# Altium project POE-3V3-Board.PrjPcb
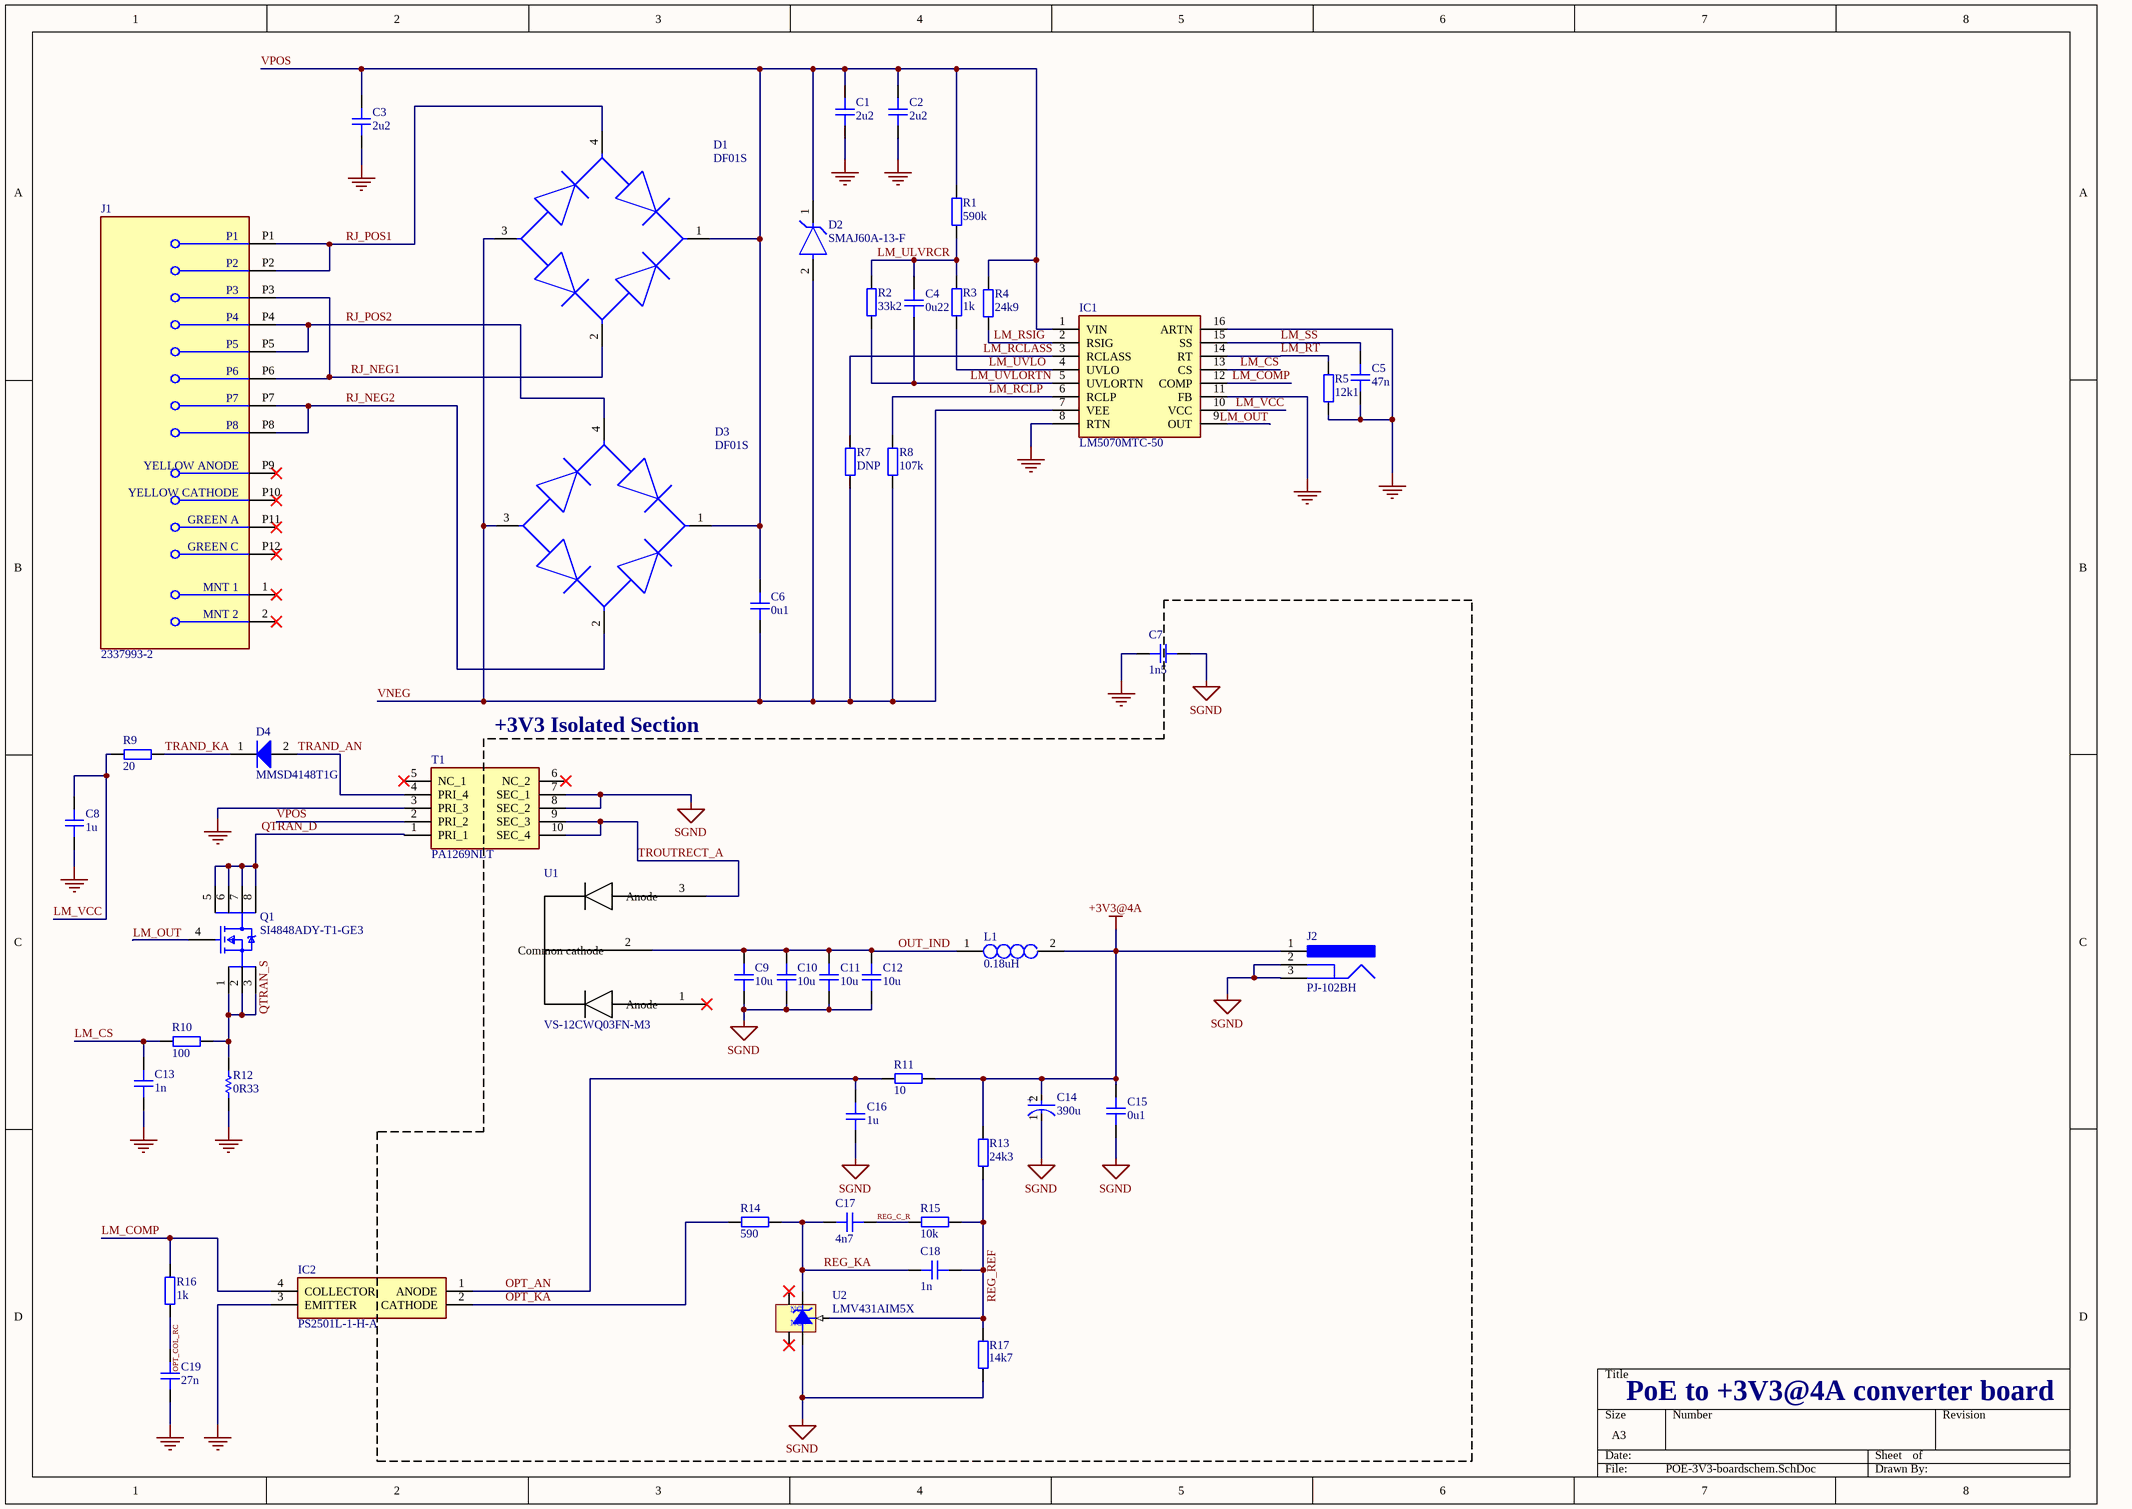
[diagram p0: POE-3V3-boardschem.SchDoc]
1 sheet, 48 parts. Net scope: global (net labels, ports and power ports of the same name join across sheets).
Board file: POE-3V3-PCB.PcbDoc

## Sheet POE-3V3-boardschem.SchDoc
size A3; SheetNumber: 1; SheetTotal: 1

### Parts
C1  2u2  [CAP_0805]
C2  2u2  [CAP_0805]
C3  2u2  [CAP_0805]
C4  0u22  [CAP_0805]
C5  47n  [CAP_0805]
C6  0u1  [CAP_0805]
C7  1n5  [CAP_0805]
C8  1u  [CAP_0805]
C9  10u  [CAP_1206]
C10  10u  [CAP_1206]
C11  10u  [CAP_1206]
C12  10u  [CAP_1206]
C13  1n  [CAP_0805]
C14  390u  [FP-RAD-TH-D_8_0_5-L_15_1-MFG]
C15  0u1  [CAP_0805]
C16  1u  [CAP_1206]
C17  4n7  [CAP_1206]
C18  1n  [CAP_1206]
C19  27n  [CAP_1206]
D1  DF01S  [FP-DF-S-MFG]
D2  SMAJ60A-13-F  [FP-SMA-MFG]
D3  DF01S  [FP-DF-S-MFG]
D4  MMSD4148T1G  [ONSC-SOD-123-2-425-04_V]
IC1  LM5070MTC-50  [SOP65P640X120-16N]
IC2  PS2501L-1-H-A  [SOP254P960X400-4N]
J1  2337993-2  [FP-2337993-2-MFG]
J2  PJ-102BH  [CUI-PJ-102BH_V]
L1  0.18uH  [DO1813H181MLD]
Q1  SI4848ADY-T1-GE3  [FP-C-06527-MFG]
R1  590k  [RES_0805]
R2  33k2  [RES_0805]
R3  1k  [RES_0805]
R4  24k9  [RES_0805]
R5  12k1  [RES_0805]
R7  DNP  [RES_0805]
R8  107k  [RES_0805]
R9  20  [RES_0805]
R10  100  [RES_0805]
R11  10  [RES_0805]
R12  0R33  [RESC3126X65X50NL10T20]
R13  24k3  [RES_0805]
R14  590  [RES_0805]
R15  10k  [RES_0805]
R16  1k  [RES_0805]
R17  14k7  [RES_0805]
T1  PA1269NLT  [PA1269NLT]
U1  VS-12CWQ03FN-M3  [DPAK_03FN-M3_VIS]
U2  LMV431AIM5X  [DBV0005A_M]

### Nets
+3V3@4A: C14.2(A) C15.2 J2.1 L1.2 R11.2 R13.1
GND: C1.1 C2.1 C3.1 C5.1 C7.2 C8.1 C13.1 C19.2 IC1.8(RTN) IC1.11(FB) IC1.16(ARTN) IC2.3(EMITTER) R5.1 R12.1 T1.3(PRI_3)
SGND: C7.1 C9.1 C10.1 C11.1 C12.1 C14.1(C) C15.1 C16.1 J2.2 J2.3 R17.2 T1.7(SEC_1) T1.8(SEC_2) U2.5(A)
LM_COMP: IC1.12(COMP) IC2.4(COLLECTOR) R16.1
LM_CS: C13.2 IC1.13(CS) R10.2
LM_OUT: IC1.9(OUT) Q1.4(G)
LM_RCLASS: IC1.3(RCLASS) R7.2
LM_RCLP: IC1.6(RCLP) R8.2
LM_RSIG: IC1.2(RSIG) R4.1
LM_RT: IC1.14(RT) R5.2
LM_SS: C5.2 IC1.15(SS)
LM_ULVRCR: C4.2 R1.1 R2.2 R3.2
LM_UVLO: IC1.4(UVLO) R3.1
LM_UVLORTN: C4.1 IC1.5(UVLORTN) R2.1
LM_VCC: C8.2 IC1.10(VCC) R9.2
OPT_AN: C16.2 IC2.1(ANODE) R11.1
OPT_COL_RC: C19.1 R16.2
OPT_KA: IC2.2(CATHODE) R14.1
OUT_IND: C9.2 C10.2 C11.2 C12.2 L1.1 U1.2(Common_cathode)
QTRAN_D: Q1.5(D) Q1.6(D) Q1.7(D) Q1.8(D) T1.1(PRI_1)
QTRAN_S: Q1.1(S) Q1.2(S) Q1.3(S) R10.1 R12.2
REG_C_R: C17.1 R15.1
REG_KA: C17.2 C18.2 R14.2 U2.3(K)
REG_REF: C18.1 R13.2 R15.2 R17.1 U2.4(REF)
RJ_NEG1: D1.2(1_~) J1.P3 J1.P6
RJ_NEG2: D3.2(1_~) J1.P7 J1.P8
RJ_POS1: D1.4(2_~) J1.P1 J1.P2
RJ_POS2: D3.4(2_~) J1.P4 J1.P5
TRAND_AN: D4.2(A) T1.4(PRI_4)
TRAND_KA: D4.1(K) R9.1
TROUTRECT_A: T1.9(SEC_3) T1.10(SEC_4) U1.3(Anode)
VNEG: C6.1 D1.3(-) D2.2(A) D3.3(-) IC1.7(VEE) R7.1 R8.1
VPOS: C1.2 C2.2 C3.2 C6.2 D1.1(+) D2.1(C) D3.1(+) IC1.1(VIN) R1.2 R4.2 T1.2(PRI_2)

Not connected (* = marked no-connect by the designer): J1 1(MNT_1)* 2(MNT_2)* P9(YELLOW_ANODE)* P10(YELLOW_CATHODE)* P11(GREEN_A)* P12(GREEN_C)*; T1 5(NC_1)* 6(NC_2)*; U1 1(Anode)*; U2 1(NC)* 2(NC)*

### Notes on the sheet
- (near T1) +3V3 Isolated Section
- PoE to +3V3@4A converter board
- (in symbol CMP-05427-000460-1) +

### Library data of the parts
C1-C8 C13 = CAP_0805: Capacitor SMD 0805; Rating: 100V; Manufacturer: *; Manufacturer Part Number: *; Distributor Link: *; LCSC: *; Dielectric: *
C9-C12 C16-C19 = CAP_1206: Capacitor SMD 1206; Rating: 10V; Manufacturer: *; Manufacturer Part Number: *; Distributor Link: *; LCSC: *; Dielectric: *
C14 = CMP-05427-000460-1: Aluminum Electrolytic Capacitors (Radial Lead Type) 390uF ±20% 25V; Impedance: 41mR; Lead Diameter: 0.6mm; Ripple Current (AC): 1.24A; Life (Hours): 8000Hour; Dielectric Material: Aluminium; Length: 15mm; Case/Package: Radial; Termination: Radial; Tolerance: 20%; Series: FR; RoHS Compliant: Yes; Height: 15mm; Package Quantity: 200; Construction: RADIAL; Diameter: 8mm; Mount: Through Hole; REACH SVHC: No SVHC; Voltage Rating: 25V; Packaging: Bulk; ESR (Equivalent Series Resistance): 41mR; Min Operating Temperature: -40°C; Ripple Current: 1.24A; Max Operating Temperature: 105°C; Lead Pitch: 3.5mm; Radiation Hardening: No; Capacitance: 390uF; Voltage: 25V; Number of Pins: 2; Height - Seated (Max): 0.65inch; Voltage Rating (DC): 25V
C15 = CAP_0805: Capacitor SMD 0805; Rating: 10V; Manufacturer: *; Manufacturer Part Number: *; Distributor Link: *; LCSC: *; Dielectric: *
D1 D3 = CMP-12791-000062-1: BRIDGE RECT 1PHASE 100V 1A DFS; Number of Elements: 1; Forward Voltage: 1.1V; Max Reverse Current: 10A; Element Configuration: Single; Capacitance: 25pF; Reverse Voltage (DC): 70V; Peak Non-Repetitive Surge Current: 50A; Number of Pins: 4; Termination: SMD/SMT; Case/Package: SMD/SMT; Output Current: 1A; Packaging: Rail/Tube; Current Rating: 1A; Length: 8.51mm; Mount: Surface Mount; RoHS Compliant: Yes; Voltage Rating (DC): 100V; Series: -; Height: 3.4mm; Average Rectified Current: 1A; Min Operating Temperature: -65°C; Package Quantity: 50; Max Surge Current: 50A; Width: 6.5mm; Max Operating Temperature: 150°C; Lead Free: Lead Free; Weight: 0.010547oz; Max Repetitive Reverse Voltage (Vrrm): 100V; Radiation Hardening: No
D2 = CMP-12828-000005-1: TVS DIODE 60V 96.8V SMA; Manufacturer: Diodes Inc.; Max Junction Temp: +150°C; Peak Pulse Power: 400W; Direction: Unidirectional; Breakdown Voltage: 66.7V; Standoff Height: 0.05mm; Peak Pulse Current: 4.1A; Number Of Channels: 1; Temperature Range High: +150°C; Manufacturer Part Number: SMAJ60A-13-F; Device Class L2: TVS Diodes; Temperature Range Low: -55°C; Height: 2.4mm; Device Class L3: unset; Device Class L1: Circuit Protection; ComponentLink2URL: https://www.diodes.com/assets/Datasheets/ds19005.pdf; Octopart: https://octopart.com/smaj60a-13-f-diodes+inc.-350240; Category: Diode; Temperature: -55°C to +150°C; RoHS: TRUE; Clamping Voltage: 96.8V; ComponentLink2Description: Datasheet; Footprint Url: https://www.diodes.com/assets/Package-Files/SMA.pdf; Automotive: No; Lead Free: Yes; Digikey Description: TVS DIODE 60V 96.8V SMA; Package: SMA; Reverse Standoff Voltage: 60V
D4 = CMP-0895-00001-2: Switching Diode, 2-Pin SOD-123, Pb-Free, Tape and Reel; Manufacturer: On Semiconductor; trr Max (ns): 4; IF Max (A): 0.2; Configuration: Single; Mounting Technology: Surface Mount; ComponentLink2URL: http://www.onsemi.com/pub_link/Collateral/MMSD4148T1-D.PDF; ComponentLink1Description: Manufacturer URL; ComponentLink1URL: http://www.onsemi.com/; PartNumber: MMSD4148T1G; ComponentLink2Description: Datasheet; PackageDescription: 2-Pin SOD, Body 1.6 x 2.69 mm; Packing: Tape and Reel; DatasheetVersion: Rev. 11; PackageReference: SOD-123-2-425-04; ComponentLink3Description: Package Specification; ComponentLink3URL: http://www.onsemi.com/pub_link/Collateral/425-04.PDF; PackageVersion: Rev. G, 10/2009; RoHS: TRUE
IC1 = LM5070MTC-50: Integrated Circuit; Manufacturer_Name: Texas Instruments; Datasheet Link: https://www.ti.com/lit/ds/symlink/lm5070.pdf?ts=1651300488434&ref_url=https%253A%252F%252Fwww.ti.com%252Fstore%252Fti%252Fen%252Fp%252Fproduct%252F%253Fp%253DLM5070MTC-50%252FNOPB; Height: 1.2mm; Manufacturer_Part_Number: LM5070MTC-50; Mouser Part Number: 926-LM5070MTC-50; Mouser Price/Stock: https://www.mouser.com/Search/Refine.aspx?Keyword=926-LM5070MTC-50
IC2 = PS2501L-1-H-A: Integrated Circuit; Manufacturer_Name: Renesas Electronics; Datasheet Link: https://www.mouser.in/datasheet/2/286/ps2501-34138.pdf; Height: 4mm; Manufacturer_Part_Number: PS2501L-1-H-A; Mouser Part Number: 968-PS2501L-1-H-A; Mouser Price/Stock: https://www.mouser.co.uk/ProductDetail/Renesas-Electronics/PS2501L-1-H-A?qs=%252B6g0mu59x7Jv3GhOeMO0tw%3D%3D; Arrow Part Number: PS2501L-1-H-A; Arrow Price/Stock: https://www.arrow.com/en/products/ps2501l-1-h-a/renesas-electronics
J1 = CMP-03371-000017-1: RJ45 JACK MAG. POE 10/100 LED 1X; Manufacturer: TE Connectivity; Conn Orientation: Vertical; Is Female: yes; Pitch: 1.27mm; Shielding: true; Number Of Contacts: 8; Conn Gender: Female; Digikey Description: RJ45 JACK MAG. POE 10/100 LED 1X; ComponentLink2URL: https://www.te.com/commerce/DocumentDelivery/DDEController?Action=showdoc&DocId=Customer+Drawing%7F2337993-2%7FA%7Fpdf%7FEnglish%7FENG_CD_2337993-2_A.pdf%7F2337993-2; Category: Conn; Height: 17.15mm; ComponentLink2Description: Datasheet; Temperature Range High: +85°C; Octopart: https://octopart.com/2337993-2-te+connectivity-99778114; Manufacturer Part Number: 2337993-2; Device Class L1: Connectors; RoHS: TRUE; Device Class L2: Modular / Ethernet Connectors; Package: 2337993-2; Lead Free: Yes; Contact Material: Gold,Nickel; Temperature Range Low: -40°C; Automotive: No; Temperature: -40°C to +85°C; Device Class L3: unset
J2 = CMP-2000-06901-1: Through Hole Right Angle DC Power Jack, 5 A, 2.5 mm Center Pin, 3 Position, -25 to 85 degC, RoHS, Bulk; Manufacturer: CUIInc.; Outside Contact Diameter: 6.5mm; Current Rating: 5A; Brand: CUI; Insulation Resistance: 100MOhms; Inside Contact Diameter: 2.5mm; Voltage Rating: 24V; Operating Temperature Range: -25Cto+85C; Mounting Angle: Right; Mounting Technology: ThroughHole; Product Category: DCPowerConnectors; Datasheet Version: Rev. 1.02, 05/2016; Connector Type: DCPowerJack; Contact Material: Copper; Housing Material: PolybutyleneTerephthalate(PBT); Mounting Style: ThroughHole; Product: Jacks; Package Reference: PJ-102BH; Manufacturer URL: http://www.cui.com/; RoHS: True; Contact Gender: Male; Contact Plating: Nickel; Flammability Rating: UL94V-0; Factory Pack Quantity: 280; Datasheet URL: http://www.cui.com/product/resource/pj-102bh.pdf; Package Description: 3-Pin Through Hole Device, Body 14.4 x 9 mm, Height 11 mm; Termination Style: ThroughHole
L1 = DO1813H-181MLD: Inductor; Manufacturer_Name: COILCRAFT; Datasheet Link: https://ms.componentsearchengine.com/Datasheets/1/DO1813H-181MLD.pdf; Height: 5mm; Manufacturer_Part_Number: DO1813H-181MLD; Mouser Part Number: 994-DO1813H-181MLD; Mouser Price/Stock: https://www.mouser.co.uk/ProductDetail/Coilcraft/DO1813H-181MLD?qs=zCSbvcPd3pZl8OzSYavKew%3D%3D
Q1 = CMP-02550-000028-1: MOSFET N-CH 150V 5.5A 8SOIC; Manufacturer: Vishay; Number Of N Channels: 1; Reverse Recovery Time: 57ns; Threshold Vgs Max: 4V; Transconductance: 5S; Input Capacitace At Vds: 335pF @ 75V; Reverse Recovery Charge: 110nC; Max Junction Temp: +150°C; Continuous Drain Current: 3.9A; Pulse Drain Current: 20A; Power Dissipation: 2.5W; Threshold Vgs Min: 2V; Turn On Delay Time: 8ns; Drain To Source Resistance: 0.07Ω; Rthja Max: 43°C/W; Typ Forward Diode Voltage: 0.85V; Gate Charge At Vgs: 6.5nC @ 10V; Max Forward Diode Voltage: 1.2V; Gate To Source Voltage: 20V; Standoff Height: 0.1mm; Depletion Mode: False; Turn Off Delay Time: 12ns; Mouser Description: ThunderFET Power MOSFET N-Channel Single 150V VDS ±20V VGS 5.5A ID 8-Pin SOIC T/R; RoHS: TRUE; Ipc Land Pattern Name: SOIC127P600X155-8; Temperature Range Low: -55°C; ComponentLink2URL: https://www.vishay.com/docs/77716/si4848ady.pdf; Device Class L1: Discrete Semiconductors; Number Of Channels: 1; Device Class L2: Transistors; Automotive: No; Octopart: https://octopart.com/si4848ady-t1-ge3-vishay-88182557; Height: 1.75mm; Package: C-06527; Drain To Source Voltage: 150V; ComponentLink2Description: Datasheet; Lead Free: Yes; Drain To Source Breakdown Voltage: 150V; Manufacturer Part Number: SI4848ADY-T1-GE3; Digikey Description: MOSFET N-CH 150V 5.5A 8SOIC; Temperature Range High: +150°C; Device Class L3: MOSFETs; Category: Trans; Temperature: -55°C to +150°C; Footprint Url: https://www.vishay.com/docs/68964/si4838bd.pdf
R1-R5 R7-R11 R13-R17 = RES_0805: Resistor SMD 0805; Manufacturer: *; Manufacturer Part Number: *; Distributor Link: *; LCSC: *
R12 = CMP-2005-02086-1: Part Number: RL1210FR-070R33L; Manufacturer: Yageo
T1 = PA1269NLT: Transformer; Manufacturer_Name: PULSE; Datasheet Link: https://productfinder.pulseeng.com/products/datasheets/P675.pdf; Height: 12.32mm; Manufacturer_Part_Number: PA1269NLT; Mouser Part Number: 673-PA1269NLT; Mouser Price/Stock: https://www.mouser.co.uk/ProductDetail/Pulse-Electronics/PA1269NLT?qs=1CGoW%2F3pMwr7YASnA15U5A%3D%3D; Arrow Part Number: PA1269NLT; Arrow Price/Stock: https://www.arrow.com/en/products/pa1269nlt/pulse-electronics-corporation
U1 = VS-12CWQ03FN-M3: Schottky - D-PAK; Manufacturer_Name: Vishay; Copyright: Copyright (C) 2025 Ultra Librarian. All rights reserved.; Manufacturer_Part_Number: VS-12CWQ03FN-M3; Datasheet: https://www.vishay.com/doc?93285; RefDes: RefDes; Type: Type
U2 = CMP-0063-00864-3: Low-Voltage (1.24V) Adjustable Precision Shunt Regulators, 5-pin SOT-23; Manufacturer: Texas Instruments; CompType: MiscPower; PackageTopMarking: N08A*XTT; PowerWise: N; PackageDescription: Molded SOT-23, .115 x .063 x .040 in Body, 5 Lead, .0375 in Pitch; PinCount: 5; ComponentLink1URL: http://www.ti.com/general/docs/lit/getliterature.tsp?genericPartNumber=LMV431A&fileType=pdf; PackageReference: DBV0005A; ComponentLink1Description: Datasheet URL; RoHS: N